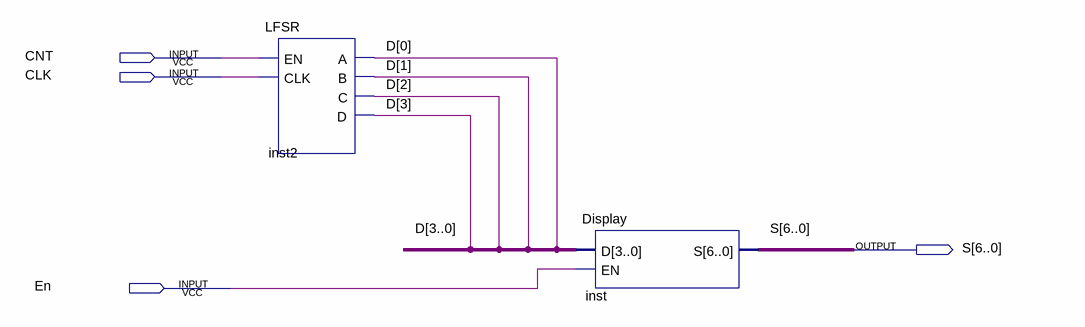
[diagram p0: schematic sheet]
// Quartus schematic LFSRDisplay.bdf as structural Verilog: 2 symbols, 4 pins
module LFSRDisplay (
  input  CNT,
  input  CLK,
  input  En,
  output [6:0] S
);

  wire [3:0] D;

  LFSR inst2 (.EN(CNT), .CLK(CLK), .A(D[0]), .B(D[1]), .C(D[2]), .D(D[3]));
  Display inst (.D(D), .EN(En), .S(S));
endmodule
